# Altium schematic sheet Solar_tracker_final_schematic_altium.SchDoc
size B; SheetNumber: 1; SheetTotal: 1
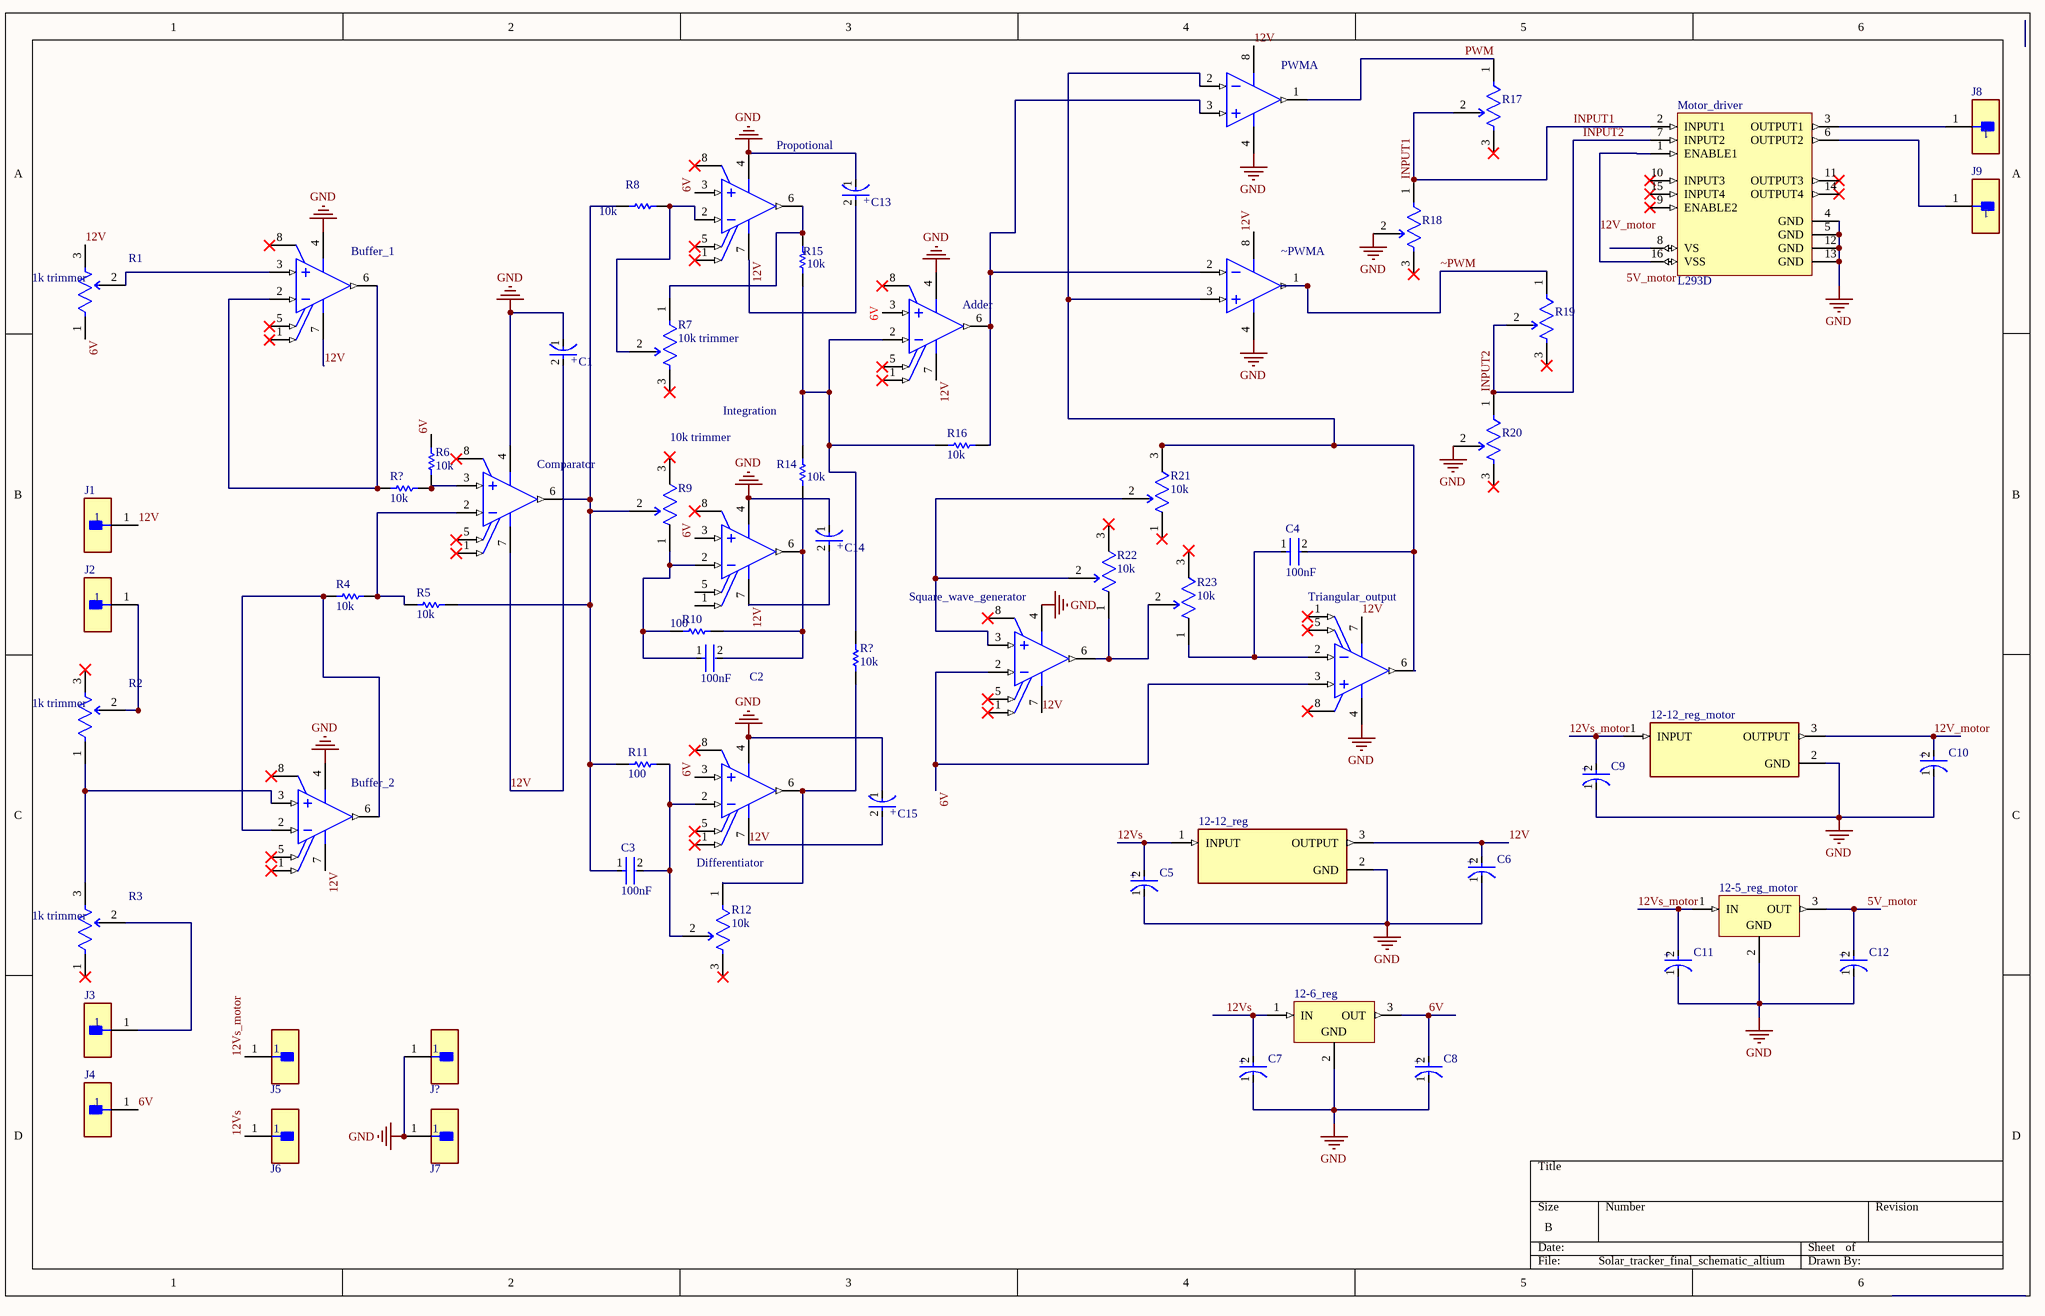
[diagram p0: Solar_tracker_final_schematic_altium.SchDoc]

## Parts
(Parts that share a designator on the sheet are numbered #1, #2 ... from top to bottom, then left to right.)
12-5_reg_motor  LM7805CT  [FAIR-TO-220-3]  (value not drawn)
12-6_reg  LM7805CT  [FAIR-TO-220-3]  (value not drawn)
12-12_reg  LM7812CT  [FP-TO220B03-MFG]  (value not drawn)
12-12_reg_motor  LM7812CT  [FP-TO220B03-MFG]  (value not drawn)
Adder  Adder  [P0008A]  (value not drawn)
Buffer_1  Buffer_1  [P0008A]  (value not drawn)
Buffer_2  Buffer_2  [P0008A]  (value not drawn)
C1  EEUFK1C472L  [FP-RAD-TH-D_12_5_0_5-L_40-MFG]  (value not drawn)
C2  100nF  [FP-RDE5E1+0_5-4-MFG]
C3  100nF  [FP-RDE5E1+0_5-4-MFG]
C4  100nF  [FP-RDE5E1+0_5-4-MFG]
C5  EEUFK1C472L  [FP-RAD-TH-D_12_5_0_5-L_40-MFG]  (value not drawn)
C6  EEUFK1C472L  [FP-RAD-TH-D_12_5_0_5-L_40-MFG]  (value not drawn)
C7  EEUFK1C472L  [FP-RAD-TH-D_12_5_0_5-L_40-MFG]  (value not drawn)
C8  EEUFK1C472L  [FP-RAD-TH-D_12_5_0_5-L_40-MFG]  (value not drawn)
C9  EEUFK1C472L  [FP-RAD-TH-D_12_5_0_5-L_40-MFG]  (value not drawn)
C10  EEUFK1C472L  [FP-RAD-TH-D_12_5_0_5-L_40-MFG]  (value not drawn)
C11  EEUFK1C472L  [FP-RAD-TH-D_12_5_0_5-L_40-MFG]  (value not drawn)
C12  EEUFK1C472L  [FP-RAD-TH-D_12_5_0_5-L_40-MFG]  (value not drawn)
C13  EEUFK1C472L  [FP-RAD-TH-D_12_5_0_5-L_40-MFG]  (value not drawn)
C14  EEUFK1C472L  [FP-RAD-TH-D_12_5_0_5-L_40-MFG]  (value not drawn)
C15  EEUFK1C472L  [FP-RAD-TH-D_12_5_0_5-L_40-MFG]  (value not drawn)
Comparator  Comparator  [P0008A]  (value not drawn)
Differentiator  Differentiator  [P0008A]  (value not drawn)
Integration  Integration  [P0008A]  (value not drawn)
J1  PBC01SAAN  [FP-PBC01SAAN-MFG]  (value not drawn)
J2  PBC01SAAN  [FP-PBC01SAAN-MFG]  (value not drawn)
J3  PBC01SAAN  [FP-PBC01SAAN-MFG]  (value not drawn)
J4  PBC01SAAN  [FP-PBC01SAAN-MFG]  (value not drawn)
J5  PBC01SAAN  [FP-PBC01SAAN-MFG]  (value not drawn)
J6  PBC01SAAN  [FP-PBC01SAAN-MFG]  (value not drawn)
J7  PBC01SAAN  [FP-PBC01SAAN-MFG]  (value not drawn)
J8  PBC01SAAN  [FP-PBC01SAAN-MFG]  (value not drawn)
J9  PBC01SAAN  [FP-PBC01SAAN-MFG]  (value not drawn)
J?  PBC01SAAN  [FP-PBC01SAAN-MFG]  (value not drawn)
Motor_driver  L293D  [STM-L293D-16]
Propotional  Propotional  [P0008A]  (value not drawn)
PWM  TL072CP  [P0008A]  (value not drawn)  (part A of 2)
R1  1k trimmer  [FP-3296Y-MFG]
R2  1k trimmer  [FP-3296Y-MFG]
R3  1k trimmer  [FP-3296Y-MFG]
R4  10k  [RESA60-630X240]
R5  10k  [RESA60-630X240]
R6  10k  [RESA60-630X240]
R7  10k trimmer  [FP-3296Y-MFG]
R8  10k  [RESA60-630X240]
R9  10k trimmer  [FP-3296W-MFG]
R10  100  [RESA60-630X240]
R11  100  [RESA60-630X240]
R12  10k  [FP-3296Y-MFG]
R14  10k  [RESA60-630X240]
R15  10k  [RESA60-630X240]
R16  10k  [RESA60-630X240]
R17  3296W-1-501LF  [FP-3296W-MFG]  (value not drawn)
R18  3296W-1-501LF  [FP-3296W-MFG]  (value not drawn)
R19  3296W-1-501LF  [FP-3296W-MFG]  (value not drawn)
R20  3296W-1-501LF  [FP-3296W-MFG]  (value not drawn)
R21  10k  [FP-3296W-MFG]
R22  10k  [FP-3296W-MFG]
R23  10k  [FP-3296W-MFG]
R?#1  10k  [RESA60-630X240]
R?#2  10k  [RESA60-630X240]
Square_wave_generator  Square_wave_generator  [P0008A]  (value not drawn)
Triangular_output  Triangular_output  [P0008A]  (value not drawn)
~PWM  TL072CP  [P0008A]  (value not drawn)  (part A of 2)

## Nets
GND: 12-5_reg_motor.2(GND) 12-6_reg.2(GND) 12-12_reg.2(GND) 12-12_reg_motor.2(GND) Adder.4(VCC-) Buffer_1.4(VCC-) Buffer_2.4(VCC-) C1.1(C) C5.1(C) C6.1(C) C7.1(C) C8.1(C) C9.1(C) C10.1(C) C11.1(C) C12.1(C) C13.1(C) C14.1(C) C15.1(C) Comparator.4(VCC-) Differentiator.4(VCC-) Integration.4(VCC-) J7.1 J?.1 Motor_driver.4(GND) Motor_driver.5(GND) Motor_driver.12(GND) Motor_driver.13(GND) Propotional.4(VCC-) PWM.4(VCC-) R18.2(WIPER) R20.2(WIPER) Square_wave_generator.4(VCC-) Triangular_output.4(VCC-) ~PWM.4(VCC-)
5V_motor: 12-5_reg_motor.3(OUT) C12.2(A)
6V: 12-6_reg.3(OUT) Adder.3(IN+) C8.2(A) Differentiator.3(IN+) Integration.3(IN+) J4.1 Propotional.3(IN+) R1.1(CCW) R6.2 Square_wave_generator.2(IN-) Triangular_output.3(IN+)
12V: 12-12_reg.3(OUTPUT) Adder.7(VCC+) Buffer_1.7(VCC+) Buffer_2.7(VCC+) C1.2(A) C6.2(A) C13.2(A) C14.2(A) C15.2(A) Comparator.7(VCC+) Differentiator.7(VCC+) Integration.7(VCC+) J1.1 Propotional.7(VCC+) PWM.8(VCC+) R1.3(CW) Square_wave_generator.7(VCC+) Triangular_output.7(VCC+) ~PWM.8(VCC+)
12V_motor: 12-12_reg_motor.3(OUTPUT) C10.2(A) Motor_driver.1(ENABLE1) Motor_driver.16(VSS)
12Vs: 12-6_reg.1(IN) 12-12_reg.1(INPUT) C5.2(A) C7.2(A) J6.1
12Vs_motor: 12-5_reg_motor.1(IN) 12-12_reg_motor.1(INPUT) C9.2(A) C11.2(A) J5.1
INPUT1: Motor_driver.2(INPUT1) R17.2(WIPER) R18.1(CCW)
INPUT2: Motor_driver.7(INPUT2) R19.2(WIPER) R20.1(CCW)
PWM: PWM.1(OUT1) R17.1(CCW)
~PWM: R19.1(CCW) ~PWM.1(OUT1)
NetAdder_2: Adder.2(IN-) R14.2 R15.1 R16.1 R?#2.2
NetAdder_6: Adder.6(OUT) PWM.3(IN1+) R16.2 ~PWM.2(IN1-)
NetBuffer_1_2: Buffer_1.2(IN-) Buffer_1.6(OUT) R?#1.1
NetBuffer_1_3: Buffer_1.3(IN+) R1.2(WIPER)
NetBuffer_2_2: Buffer_2.2(IN-) Buffer_2.6(OUT) R4.1
NetBuffer_2_3: Buffer_2.3(IN+) R2.1(CCW) R3.3(CW)
NetC2_1: C2.1 Integration.2(IN-) R9.1(CCW) R10.1
NetC2_2: C2.2 Integration.6(OUT) R10.2 R14.1
NetC3_1: C3.1 Comparator.6(OUT) R5.2 R8.1 R9.2(WIPER) R11.1
NetC3_2: C3.2 Differentiator.2(IN-) R11.2 R12.2(WIPER)
NetC4_1: C4.1 R23.1(CCW) Triangular_output.2(IN-)
NetC4_2: C4.2 PWM.2(IN1-) R21.3(CW) Triangular_output.6(OUT) ~PWM.3(IN1+)
NetComparator_2: Comparator.2(IN-) R4.2 R5.1
NetComparator_3: Comparator.3(IN+) R6.1 R?#1.2
NetDifferentiator_6: Differentiator.6(OUT) R12.1(CCW) R?#2.1
NetJ2_1: J2.1 R2.2(WIPER)
NetJ3_1: J3.1 R3.2(WIPER)
NetJ8_1: J8.1 Motor_driver.3(OUTPUT1)
NetJ9_1: J9.1 Motor_driver.6(OUTPUT2)
NetPropotional_2: Propotional.2(IN-) R7.2(WIPER) R8.2
NetPropotional_6: Propotional.6(OUT) R7.1(CCW) R15.2
NetR21_2: R21.2(WIPER) R22.2(WIPER) Square_wave_generator.3(IN+)
NetR22_1: R22.1(CCW) R23.2(WIPER) Square_wave_generator.6(OUT)

Not connected (* = marked no-connect by the designer): Adder 1(OFFSET_N1)* 5(OFFSET_N2)* 8(NC)*; Buffer_1 1(OFFSET_N1)* 5(OFFSET_N2)* 8(NC)*; Buffer_2 1(OFFSET_N1)* 5(OFFSET_N2)* 8(NC)*; Comparator 1(OFFSET_N1)* 5(OFFSET_N2)* 8(NC)*; Differentiator 1(OFFSET_N1)* 5(OFFSET_N2)* 8(NC)*; Integration 1(OFFSET_N1) 5(OFFSET_N2) 8(NC)*; Motor_driver 8(VS) 9(ENABLE2)* 10(INPUT3)* 11(OUTPUT3)* 14(OUTPUT4)* 15(INPUT4)*; Propotional 1(OFFSET_N1)* 5(OFFSET_N2)* 8(NC)*; R2 3(CW)*; R3 1(CCW)*; R7 3(CW)*; R9 3(CW)*; R12 3(CW)*; R17 3(CW)*; R18 3(CW)*; R19 3(CW)*; R20 3(CW)*; R21 1(CCW)*; R22 3(CW)*; R23 3(CW)*; Square_wave_generator 1(OFFSET_N1)* 5(OFFSET_N2)* 8(NC)*; Triangular_output 1(OFFSET_N1)* 5(OFFSET_N2)* 8(NC)*

## Notes on the sheet
- Labels drawn without touching a wire or pin: 5V_motor
- (in symbol CMP-05427-001252-1) +

## Library data of the parts
12-5_reg_motor 12-6_reg = CMP-2000-04938-1: Positive Voltage Regulator, 5 V, 1 A, -40 to 125 degC, 3-Pin TO-220, RoHS, Tube; Manufacturer: FairchildSemiconductor; Maximum Input Voltage: 35V; Maximum Quiescent Current: 8mA; Load Regulation: 100mV; Maximum Output Current: 2.2(Typ)A; Output Type: Fixed; Typical Dropout Voltage @ Current: 2@1AV; Rad Hard: No; Output Voltage: 5V; Accuracy: ±4%; Number of Outputs: 1; Category: LinearRegulator; Package Description: 3-Pin Through Hole Device, Body 10 x 4.5 mm, Pitch 2.54 mm; Packaging: Rail/Tube; Mounting: ThroughHole; Polarity: Positive; Manufacturer URL: https://www.fairchildsemi.com/; Line Regulation: 100mV; Datasheet Version: Aug-12; Datasheet URL: https://datasheet.ciiva.com/26904/lm7805ct-26904988.pdf; Package Reference: TO-220; Package URL: https://www.fairchildsemi.com/package-drawings/TO/TO220B03.pdf; Package: 3TO-220AB; Operating Temperature: -40to125degC; Type: Linear
12-12_reg 12-12_reg_motor = CMP-07128-000015-1: IC REG LINEAR 12V 1A TO220-3; Obsolete Part: true; Manufacturer: ON Semiconductor; Nominal Supply Current: 5.1mA; Output Type: Fixed; Dropout Voltage: 2V; Max Supply Voltage: 35V; Accuracy Percentage: 4%; Standoff Height: 2.7mm; Number Of Outputs: 1; Octopart: https://octopart.com/lm7812ct-on+semiconductor-14383031; Output Current: 1A; ComponentLink2Description: Datasheet; Device Class L1: Integrated Circuits (ICs); Device Class L2: Power Management ICs; Temperature Range Low: -40°C; Category: IC; Package: TO220B03; Device Class L3: Voltage Regulators - Linear; RoHS: TRUE; Digikey Description: IC REG LINEAR 12V 1A TO220-3; Ipc Land Pattern Name: TO-220; Output Voltage: 12V; Temperature: -40°C to +125°C; Automotive: No; Temperature Range High: +125°C; ComponentLink2URL: https://www.mouser.in/datasheet/2/308/LM7812-1125088.pdf; Manufacturer Part Number: LM7812CT; Height: 20.4mm; Lead Free: Yes
Adder Buffer_1 Buffer_2 Comparator Differentiator Integration Propotional Square_wave_generator Triangular_output = CMP-0017-00973-2: General-Purpose Operational Amplifier, 7 to 36 V, 0 to 70 degC, 8-pin DIP (P8), Pb-Free (RoHS); PartNumber: UA741CP; Manufacturer: Texas Instruments; Iq per channel(Max)(mA): 2.8; Number of Channels: 1; Total Supply Voltage(Min)(+5V is 5, +/-5V is 10): 7; IIB(Max)(pA): 800000; Slew Rate(Typ)(V/us): 0.5; Total Supply Voltage(Max)(+5V is 5, +/-5V is 10): 36; Vio (25C)(Max)(mV): 6; CMRR(Min)(dB): 70; Sub Family: General Purpose Amplifier, High Supply Voltage Amplifier (>=30V); PackageVersion: 4040082/E, 04/2010; PackageReference: P0008A; ComponentLink1URL: http://www.ti.com/; Mounting Technology: Through Hole; ComponentLink1Description: Manufacturer URL; GBW(Typ)(MHz): 1; ComponentLink2Description: Datasheet; ComponentLink2URL: http://www.ti.com/lit/ds/symlink/ua741.pdf; Code_JEDEC: MS-001; ComponentLink3Description: Package Specification; DatasheetVersion: SLOS094B; ComponentLink3URL: http://www.ti.com/litv/pdf/mpdi001b; PackageDescription: 8-Pin Plastic In-Line, Body 9.59 x 6.35 mm, Pitch 2.54 mm; Eco-Plan: Pb-Free (RoHS)
C1 C5-C15 = CMP-05427-001252-1: Aluminum Electrolytic Capacitors (Radial Lead Type) AEC-Q200 Qualified 4700uF ±20% 16V; Dielectric Material: Aluminium; Impedance: 14mR; Capacitance: 4.7mF; Life (Hours): 5000Hour; Lead Diameter: 0.8mm; Ripple Current: 3.01A; Voltage: 16V; Voltage Rating: 16V; Lead Pitch: 5mm; Construction: RADIAL; Voltage Rating (DC): 16V; Tolerance: 20%; Case/Package: Radial; Mount: Through Hole; Radiation Hardening: No; Min Operating Temperature: -55°C; RoHS Compliant: Yes; Series: FK Radial; Height: 40mm; Termination: Radial; REACH SVHC: No SVHC; Packaging: Bulk; Diameter: 12.5mm; Number of Pins: 2; Max Operating Temperature: 105°C
C2 C3 = CMP-06035-026316-1: Ceramic Capacitor 100nF ±10% 1kV X7R Radial; Lead Diameter: 0.5mm; Lead/Base Style: Straight; Lead Pitch: 0.197inch; Voltage Rating (DC): 1kV; Mount: Through Hole; Resistor Type: Ceramic; Case/Package: Radial; Capacitance: 100nF; Dielectric: X7R; Termination: Radial; Min Operating Temperature: -55°C; Height: 8mm; Lead Free: Lead Free; Voltage Rating: 1kV; Max Operating Temperature: 125°C; Width: 0.157inch; Package Quantity: 500; Tolerance: 10%; Height - Seated (Max): 0.315inch; Length: 7.5mm; Packaging: Bulk
C4 = CMP-06035-060479-1: Ceramic Capacitor 100nF ±10% 1kV X7R Radial; Lead/Base Style: Straight; Lead Diameter: 0.5mm; Lead Pitch: 0.197inch; Case/Package: Radial; Voltage Rating: 1kV; Lead Free: Lead Free; Package Quantity: 1; Capacitance: 100nF; Height - Seated (Max): 0.315inch; Termination: Radial; Dielectric: X7R; Width: 0.157inch; Tolerance: 10%; Resistor Type: Ceramic; Packaging: Tape and Reel; Length: 0.295inch; Max Operating Temperature: 125°C; Height: 8mm; Voltage Rating (DC): 1kV; Mount: Through Hole; Min Operating Temperature: -55°C
J1-J9 J? = CMP-25680-000032-1: CONN HEADER VERT 1POS; Number of Positions: 1; Connector Type: Male Pin; Gender: Male; Pitch: 2.54mm; Contact Material: Bronze; Mount: Through Hole; Length: 2.54mm; Height: 2.54mm; Lead Free: Lead Free; Number of Rows: 1; Contact Plating: Gold; Number of Contacts: 1; Housing Material: Plastic; Termination: Solder; Package Quantity: 1; Packaging: Bulk; Color: Black; Contact Mating Length: 0.23inch; Housing Color: Black; Width: 2.54mm
Motor_driver = CMP-2000-06524-1: Push-Pull Four Channel Driver with Diode, 4.5 to 36 V, -40 to 150 degC, 16-Pin PDIP, RoHS, Tube; Manufacturer: STMicroelectronics; Number of Outputs: 4; Current - Peak Output: 1.2A; Current - Output / Channel: 600mA; Input Type: Non-Inverting; Other Related Documents: L293DViewAllSpecifications; Dynamic Catalog: HalfBridge; Voltage - Supply: 4.5V~36V; Other Names: 497-2936-5; Package / Case: 16-DIP(0.300",7.62mm); PartNumber: L293D; Operating Temperature: -40°C~150°C; Datasheet URL: http://www.st.com/st-web-ui/static/active/en/resource/technical/document/datasheet/CD00000059.pdf; Supplier Device Package: 16-PowerDIP; Packaging: Tube; Package Description: 16-Pin Thru-Hole Dual-In-Line, Body 20 x 6.85 mm, Pitch 2.54 mm; Standard Package: 25; Datasheet Version: 07/2003; On-State Resistance: -; Manufacturer URL: http://www.st.com/; Category: IntegratedCircuits(ICs); Family: PMIC-MOSFET,BridgeDrivers-InternalSwitch; Type: HalfBridge; Series: -; Mounting Technology: ThroughHole; Package Reference: DIP-16; Mounting Type: ThroughHole
PWM ~PWM = CMP-0017-00950-2: Dual Low-Noise JFET-Input General-Purpose Operational Amplifier, 7 to 36 V, 0 to 70 degC, 8-pin DIP (P8), Pb-Free (RoHS); Manufacturer: Texas Instruments; Sub Family: General Purpose Amplifier, High Supply Voltage Amplifier (>=30V); Total Supply Voltage(Max)(+5V is 5, +/-5V is 10): 36; Slew Rate(Typ)(V/us): 13; Vn at 1kHz(Typ)(nV/rtHz): 18; GBW(Typ)(MHz): 3; CMRR(Min)(dB): 70; Total Supply Voltage(Min)(+5V is 5, +/-5V is 10): 7; Vio (25C)(Max)(mV): 10; Rating: Catalog; IIB(Max)(pA): 200; Iq per channel(Max)(mA): 2.5; Number of Channels: 2; Mounting Technology: Through Hole; ComponentLink3Description: Package Specification; PartNumber: TL072CP; PackageVersion: 4040082/E, 04/2010; Eco-Plan: Pb-Free (RoHS); DatasheetVersion: SLOS080J; Offset Drift(Typ)(uV/C): 18; ComponentLink3URL: http://www.ti.com/litv/pdf/mpdi001b; PackageDescription: 8-Pin Plastic In-Line, Body 9.59 x 6.35 mm, Pitch 2.54 mm; Code_JEDEC: MS-001; ComponentLink2URL: http://www.ti.com/lit/ds/symlink/tl072.pdf; ComponentLink1Description: Manufacturer URL; ComponentLink2Description: Datasheet; ComponentLink1URL: http://www.ti.com/; PackageReference: P0008A
R1-R3 = CMP-07234-000015-2: Manufacturer Series: 3296; Resistance: 10kR; Actuator Orientation: Vertical; Power Rating: 500mW; Temperature Coefficient: 100ppm/°C; Resistance Tolerance: 10%; Resistance Law: Linear; Number of Turns: 25; Actuator Type: SCREW; Number of Terminals/Pins: 3; Insulation Resistance: 1GR; Military Standard: Not; REACH SVHC: No SVHC; Lead Free: Lead Free; Resistor Type: Cermet; Max Operating Temperature: 125°C; Radiation Hardening: No; Package Quantity: 50; Mount: Panel; Max Power Dissipation: 500mW; Min Operating Temperature: -55°C; Type: Potentiometer; Terminal Finish: Tin; Termination: Pin; Taper: Linear; Color: Blue; Technology: CERMET; Packaging: Rail/Tube; Weight: 0.03oz; Height: 0.395inch; Number of Pins: 3; RoHS Compliant: Yes; Width: 9.53mm; Tolerance: 10%; Depth: 4.83mm; Series: 3296; Length: 9.53mm
R4-R6 R8 R14-R16 R?#1 R?#2 = CMP-1659-00074-2: Axial Resistor, 10 KOhm, +/- 1%, 0.25 W, -55 to 155 degC, 2-Pin THD, RoHS, Bulk; Manufacturer: Yageo; Temperature Coefficient: 100ppm\/degreesC; Voltage Rating: 250V; Voltage Rating (DC): 200V; Resistance: 10KOhm; Max Power Dissipation: 250mW; Datasheet URL: http://www.yageo.com/documents/recent/Yageo%20LR_MFR_2013.pdf; Packaging: Bulk; RoHSCompliant: True; Mount: ThroughHole; Package Reference: MFR-25; Termination: Axial; Composition: MetalFilm; Number of Terminations: 2; Package Quantity: 200; Mounting Technology: ThroughHole; Length: 0.248inch; Max Operating Temperature: 155degC; Min Operating Temperature: -55degC; Datasheet Version: 04/2013; Lead Free: LeadFree; Manufacturer URL: http://www.yageo.com/; Tolerance: 1%; Power Rating: 250mW; Package Description: 2-Pin Axial Lead, Dia 2.4 mm, Body Length 6.3 mm; Military Standard: Not; Case\/Package: Axial
R7 R12 = CMP-07234-000015-2: TRIMMER 10K OHM 0.5W PC PIN TOP; Manufacturer Series: 3296; Resistance: 10kR; Actuator Orientation: Vertical; Power Rating: 500mW; Temperature Coefficient: 100ppm/°C; Resistance Tolerance: 10%; Resistance Law: Linear; Number of Turns: 25; Actuator Type: SCREW; Number of Terminals/Pins: 3; Insulation Resistance: 1GR; Military Standard: Not; REACH SVHC: No SVHC; Lead Free: Lead Free; Resistor Type: Cermet; Max Operating Temperature: 125°C; Radiation Hardening: No; Package Quantity: 50; Mount: Panel; Max Power Dissipation: 500mW; Min Operating Temperature: -55°C; Type: Potentiometer; Terminal Finish: Tin; Termination: Pin; Taper: Linear; Color: Blue; Technology: CERMET; Packaging: Rail/Tube; Weight: 0.03oz; Height: 0.395inch; Number of Pins: 3; RoHS Compliant: Yes; Width: 9.53mm; Tolerance: 10%; Depth: 4.83mm; Series: 3296; Length: 9.53mm
R9 R21-R23 = CMP-07234-000024-1: TRIMMER 10K OHM 0.5W PC PIN TOP; Resistance: 10kR; Temperature Coefficient: 100ppm/°C; Power Rating: 500mW; Tolerance: 10%; Number of Turns: 25; Width: 0.19inch; Termination: Pin; Radiation Hardening: No; Contact Plating: Tin; Composition: Cermet; Length: 9.53mm; Height: 0.395inch; Depth: 4.83mm; REACH SVHC: No SVHC; Weight: 0.03oz; Min Operating Temperature: -55°C; Military Standard: Not; Max Operating Temperature: 125°C; Packaging: Tape and Reel; Package Quantity: 1; Taper: Linear; Max Power Dissipation: 500mW; Mount: Through Hole
R10 R11 = CMP-1659-00071-1: Axial Resistor, 100 Ohm, +/- 1%, 0.25 W, -55 to 155 degC, 2-Pin THD, RoHS, Bulk; Voltage Rating: 250 V; Resistance: 4.75 kohm; Power Rating: 250 mW; Type (Resistor): Metal Film; Package Quantity: 200; RoHSCompliant: true; ComponentLink1URL: http://www.yageo.com/; ComponentLink1Description: Manufacturer URL; Case\Package: Axial; ComponentLink2Description: Datasheet; Length: 0.248 inch; PackageReference: MFR-25; Max Operating Temperature: 155 degC; Min Operating Temperature: -55 degC; DatasheetVersion: Apr-13; Mount: Through Hole; PackageDescription: 2-Pin Axial Lead, Dia 2.4 mm, Body Length 6.3 mm; Packaging: Bulk; Tolerance: 1%; ComponentLink2URL: http://www.yageo.com/documents/recent/Yageo%20LR_MFR_2013.pdf
R17-R20 = CMP-07234-000046-1: TRIMMER 500 OHM 0.5W PC PIN TOP; Resistance: 500R; Temperature Coefficient: 100ppm/°C; Resistance Tolerance: 10%; Number of Turns: 25; Max Power Dissipation: 500mW; Packaging: Rail/Tube; Color: Blue; Technology: CERMET; Max Operating Temperature: 125°C; RoHS Compliant: Yes; Radiation Hardening: No; Series: 3296; Military Standard: Not; Width: 9.53mm; Weight: 0.03oz; Length: 9.53mm; Package Quantity: 50; Height: 0.395inch; Min Operating Temperature: -55°C; Lead Free: Lead Free; Mount: Through Hole; Depth: 4.83mm; Termination: Pin; Taper: Linear; Contact Plating: Tin; Resistor Type: Cermet; Tolerance: 10%; REACH SVHC: No SVHC; Power Rating: 500mW